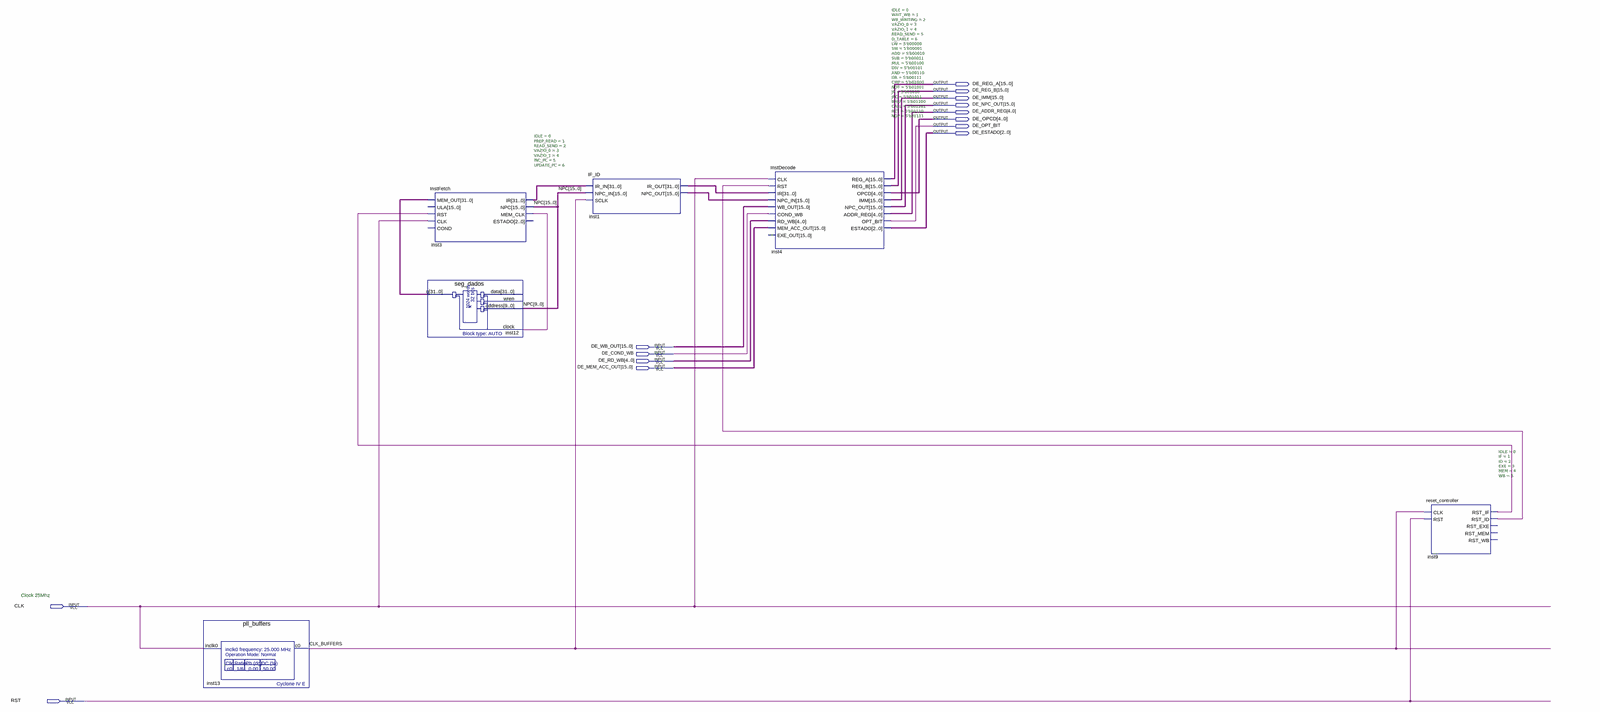
[diagram p0: schematic sheet, whole]
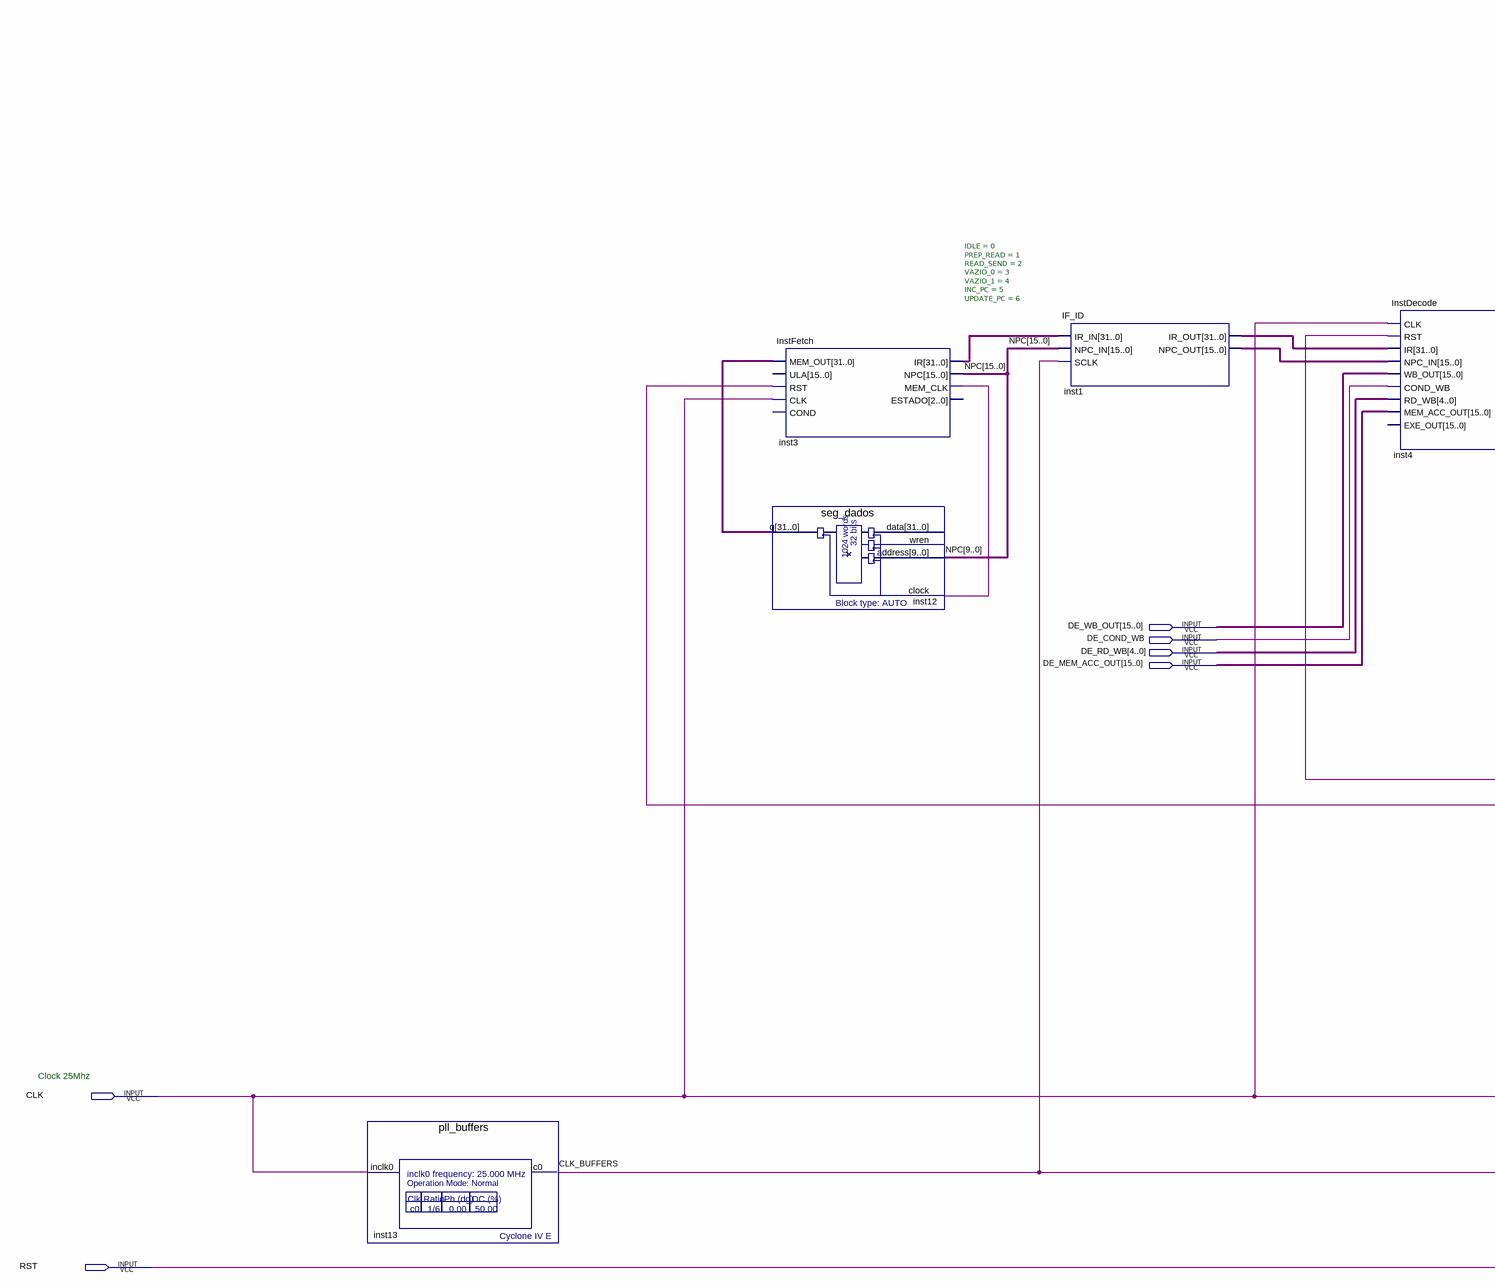
[diagram p1: schematic sheet, left part]
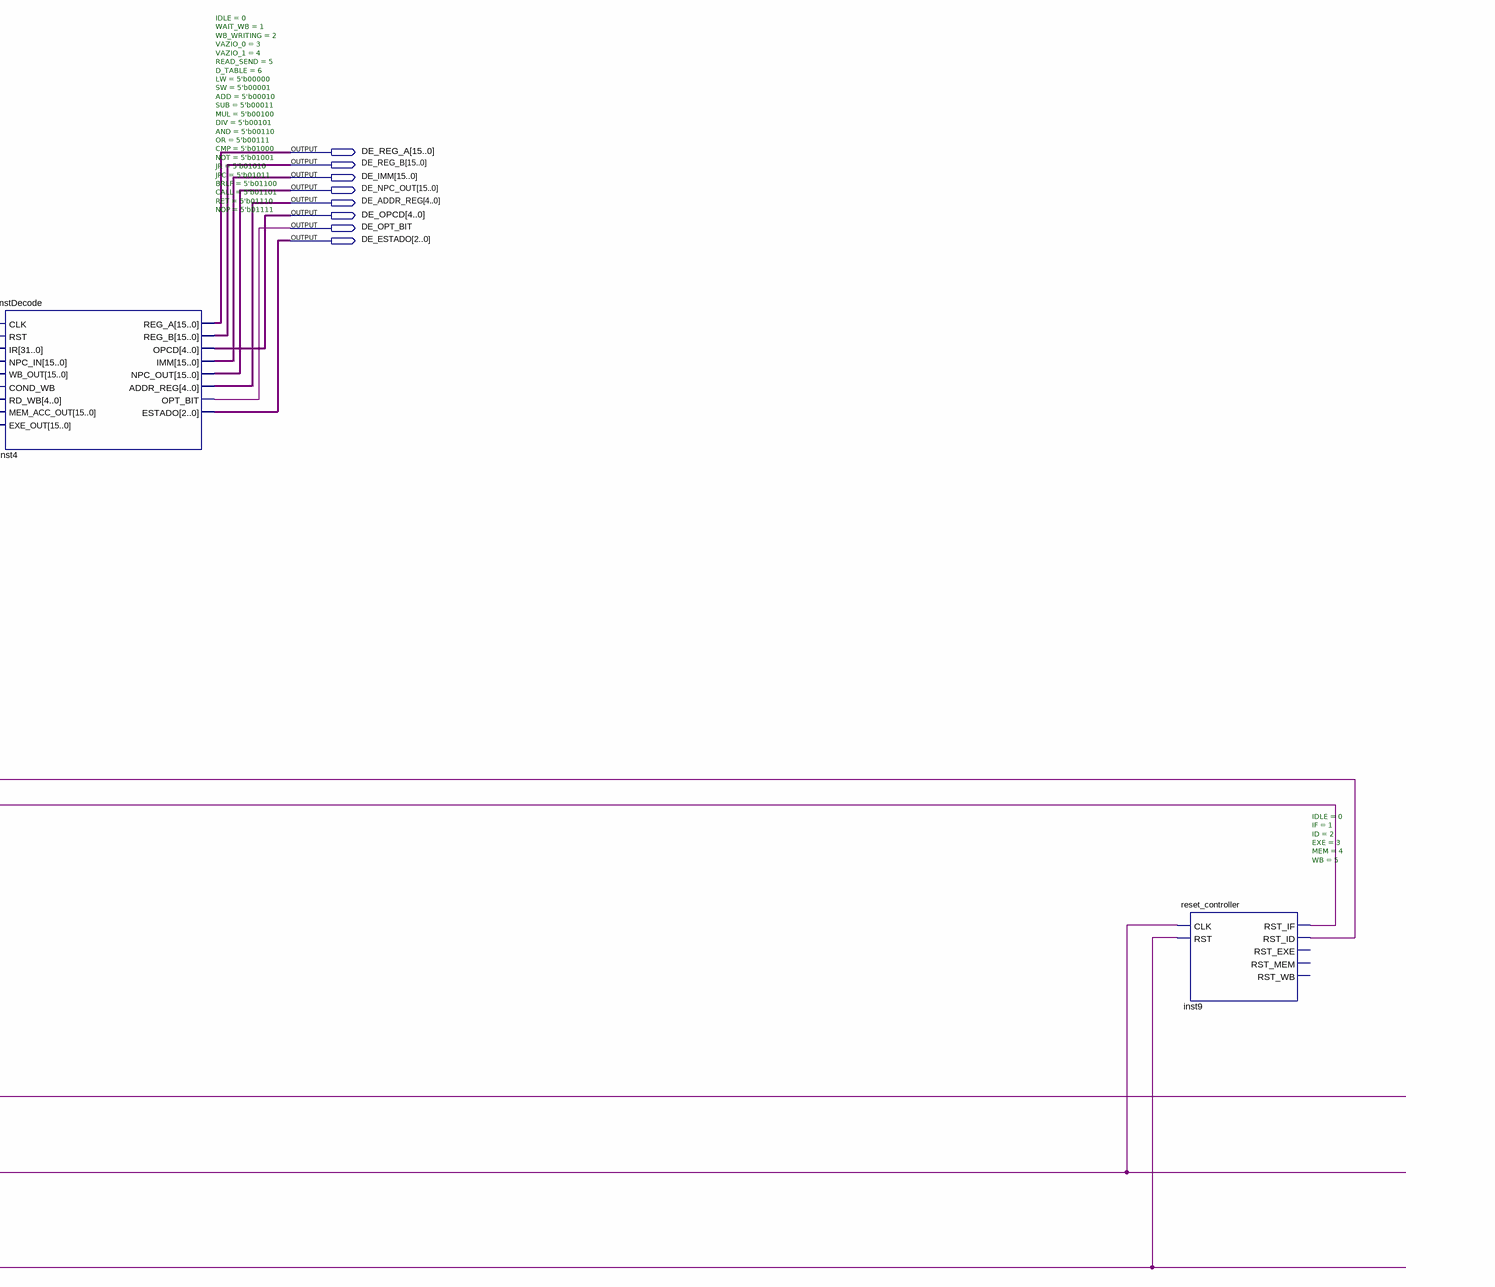
[diagram p2: schematic sheet, right part]
// Quartus schematic InstDecode_block_.bdf as structural Verilog: 6 symbols, 14 pins
module InstDecode_block_ (
  input  [15:0] DE_WB_OUT,
  input  DE_COND_WB,
  input  [4:0] DE_RD_WB,
  input  [15:0] DE_MEM_ACC_OUT,
  input  CLK,
  input  RST,
  output [15:0] DE_REG_A,
  output [15:0] DE_REG_B,
  output [15:0] DE_IMM,
  output [15:0] DE_NPC_OUT,
  output [4:0] DE_ADDR_REG,
  output [4:0] DE_OPCD,
  output DE_OPT_BIT,
  output [2:0] DE_ESTADO
);

  wire CLK_BUFFERS, inst3_mem_clk, inst9_rst_id, inst9_rst_if;
  wire [15:0] inst1_npc_out, NPC;
  wire [31:0] inst1_ir_out, inst3_ir, inst12_q;

  pll_buffers inst13 (.inclk0(CLK), .c0(CLK_BUFFERS));
  InstFetch #(.IDLE(0), .PREP_READ(1), .READ_SEND(2), .VAZIO_0(3), .VAZIO_1(4), .INC_PC(5), .UPDATE_PC(6)) inst3 (
    .MEM_OUT(inst12_q), .RST(inst9_rst_if), .CLK(CLK), .IR(inst3_ir), .NPC(NPC), .MEM_CLK(inst3_mem_clk));  // open: ULA, COND, ESTADO
  seg_dados inst12 (.address(NPC[9:0]), .clock(inst3_mem_clk), .q(inst12_q));  // open: data, wren
  IF_ID inst1 (.IR_IN(inst3_ir), .NPC_IN(NPC), .SCLK(CLK_BUFFERS), .IR_OUT(inst1_ir_out), .NPC_OUT(inst1_npc_out));
  InstDecode #(.IDLE(0), .WAIT_WB(1), .WB_WRITING(2), .VAZIO_0(3), .VAZIO_1(4), .READ_SEND(5), .D_TABLE(6), .LW(5'b00000), .SW(5'b00001), .ADD(5'b00010), .SUB(5'b00011), .MUL(5'b00100), .DIV(5'b00101), .AND(5'b00110), .OR(5'b00111), .CMP(5'b01000), .NOT(5'b01001), .JR(5'b01010), .JPC(5'b01011), .BRLF(5'b01100), .CALL(5'b01101), .RET(5'b01110), .NOP(5'b01111)) inst4 (
    .CLK(CLK), .RST(inst9_rst_id), .IR(inst1_ir_out), .NPC_IN(inst1_npc_out), .WB_OUT(DE_WB_OUT),
    .COND_WB(DE_COND_WB), .RD_WB(DE_RD_WB), .MEM_ACC_OUT(DE_MEM_ACC_OUT), .REG_A(DE_REG_A), .REG_B(DE_REG_B),
    .OPCD(DE_OPCD), .IMM(DE_IMM), .NPC_OUT(DE_NPC_OUT), .ADDR_REG(DE_ADDR_REG), .OPT_BIT(DE_OPT_BIT),
    .ESTADO(DE_ESTADO));  // open: EXE_OUT
  reset_controller #(.IDLE(0), .IF(1), .ID(2), .EXE(3), .MEM(4), .WB(5)) inst9 (
    .CLK(CLK_BUFFERS), .RST(RST), .RST_IF(inst9_rst_if), .RST_ID(inst9_rst_id));  // open: RST_EXE, RST_MEM, RST_WB

  // Notes on the sheet:
  //   Clock 25Mhz
endmodule
